# EAGLE schematic TDSensorSchematic (EAGLE 7.6.0)
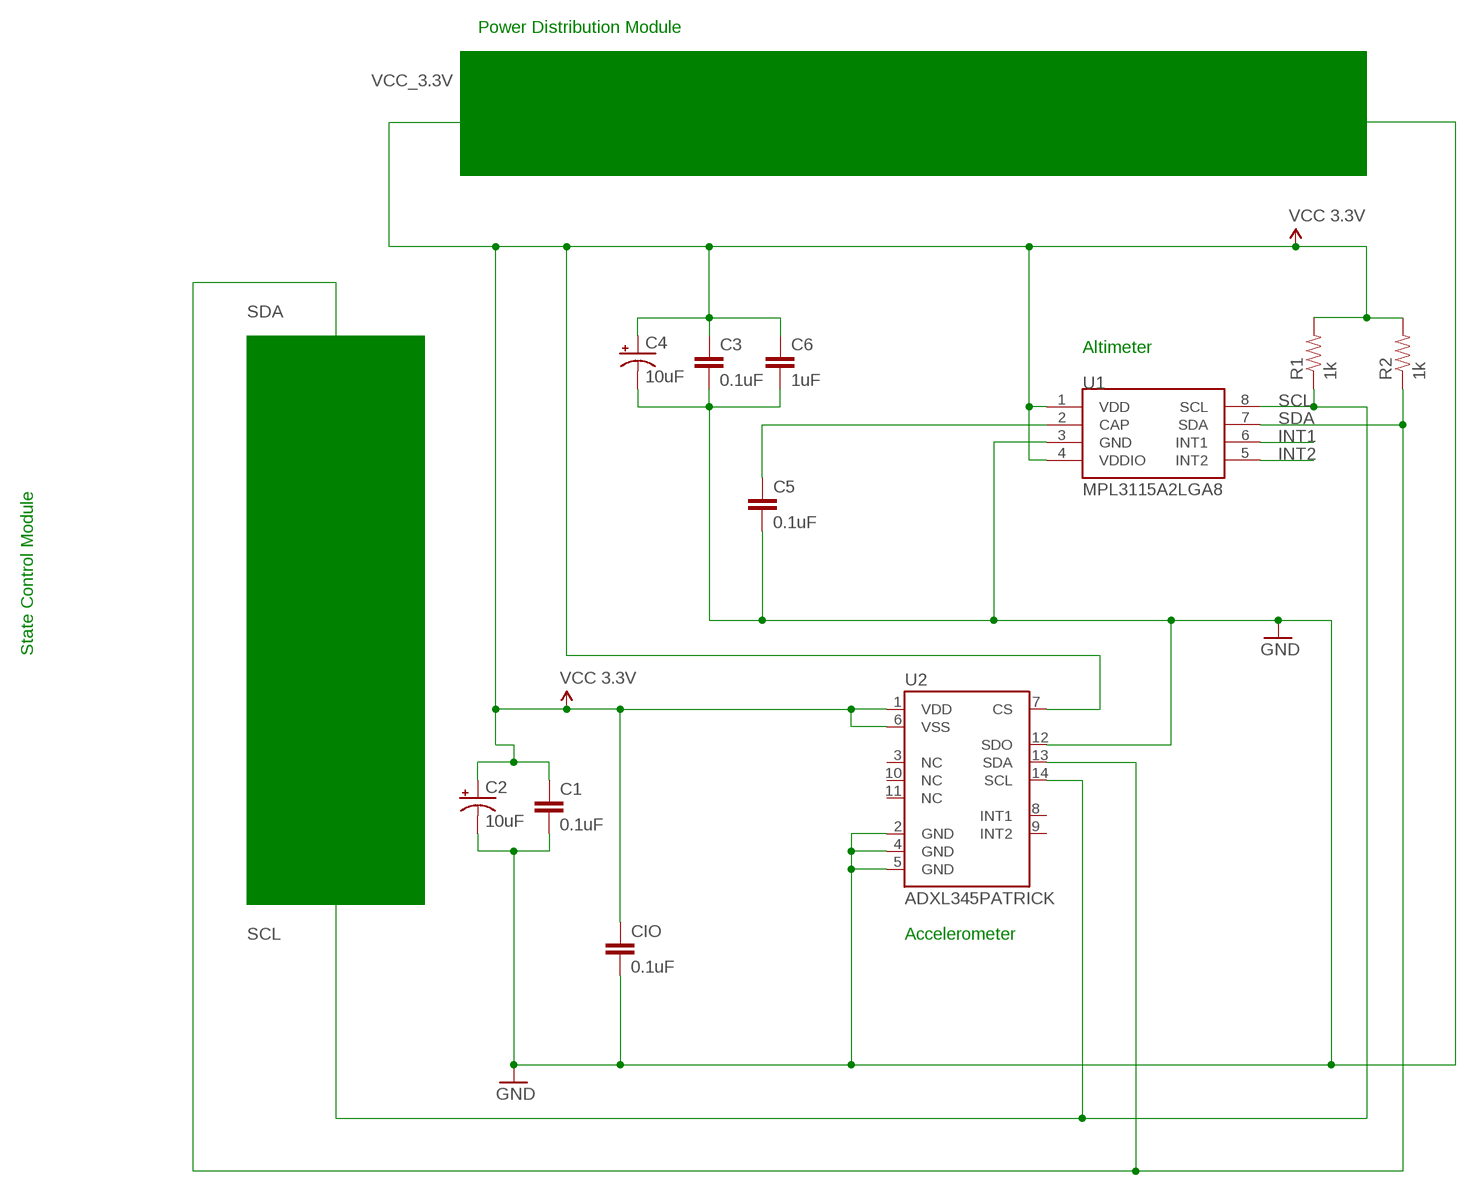
[diagram p0: schematic, sheet 1]

## Parts
C1  0.1uF  CAP0603-CAP  [0603-CAP]
C2  10uF  CAP_POL1206  [EIA3216]
C3  0.1uF  CAP0402-CAP  [0402-CAP]
C4  10uF  CAP_POL1206  [EIA3216]
C5  0.1uF  CAP0402-CAP  [0402-CAP]
C6  1uF  CAP0402-CAP  [0402-CAP]
CIO  0.1uF  CAP0603-CAP  [0603-CAP]
R1  1k  RESISTOR0402-RES  [0402-RES]
R2  1k  RESISTOR0402-RES  [0402-RES]
U1  MPL3115A2LGA8  [LGA8]
U2  ADXL345PATRICK  [LGA14_1:1_PATRICK]

## Nets
GND: C1.2 C2.C(-) C3.2 C4.C(-) C5.2 C6.2 CIO.2 U1.3(GND) U2.2(GND) U2.4(GND) U2.5(GND) U2.12(SDO)
INT1: U1.6(INT1)
INT2: U1.5(INT2)
N$1: C5.1 U1.2(CAP)
SCL: R1.1 U1.8(SCL) U2.14(SCL)
SDA: R2.1 U1.7(SDA) U2.13(SDA)
VCC_3.3V: C1.1 C2.A(+) C3.1 C4.A(+) C6.1 CIO.1 R1.2 R2.2 U1.1(VDD) U1.4(VDDIO) U2.1(VDD) U2.6(VSS) U2.7(CS) ; supply symbol labelled VCC 3.3V
Unconnected: U2.3(NC) U2.8(INT1) U2.9(INT2) U2.10(NC) U2.11(NC)

## Notes on the sheet
- Power Distribution Module
- Altimeter
- State Control Module
- Accelerometer

## Library data of the parts
C1 C3 C5 C6 CIO = SparkFun:CAP: Capacitor Standard 0603 ceramic capacitor, and 0.1" leaded capacitor.
C2 C4 = SparkFun:CAP_POL: Capacitor Polarized These are standard SMD and PTH capacitors. Normally 10uF, 47uF, and 100uF in electrolytic and tantalum varieties. Always verify the external diameter of the through hole cap, it varies with capacity, voltage, and manufacturer. The EIA devices should be standard.
R1 R2 = SparkFun:RESISTOR: Resistor Basic schematic elements and footprints for 0603, 1206, and PTH resistors.
U1 = SparkFun-Sensors:MPL3115A2: Altimeter/Pressure Sensor, I2C, 1.95V-3.6V supply, 50 to 110kPa
U2 = Testing:ADXL345